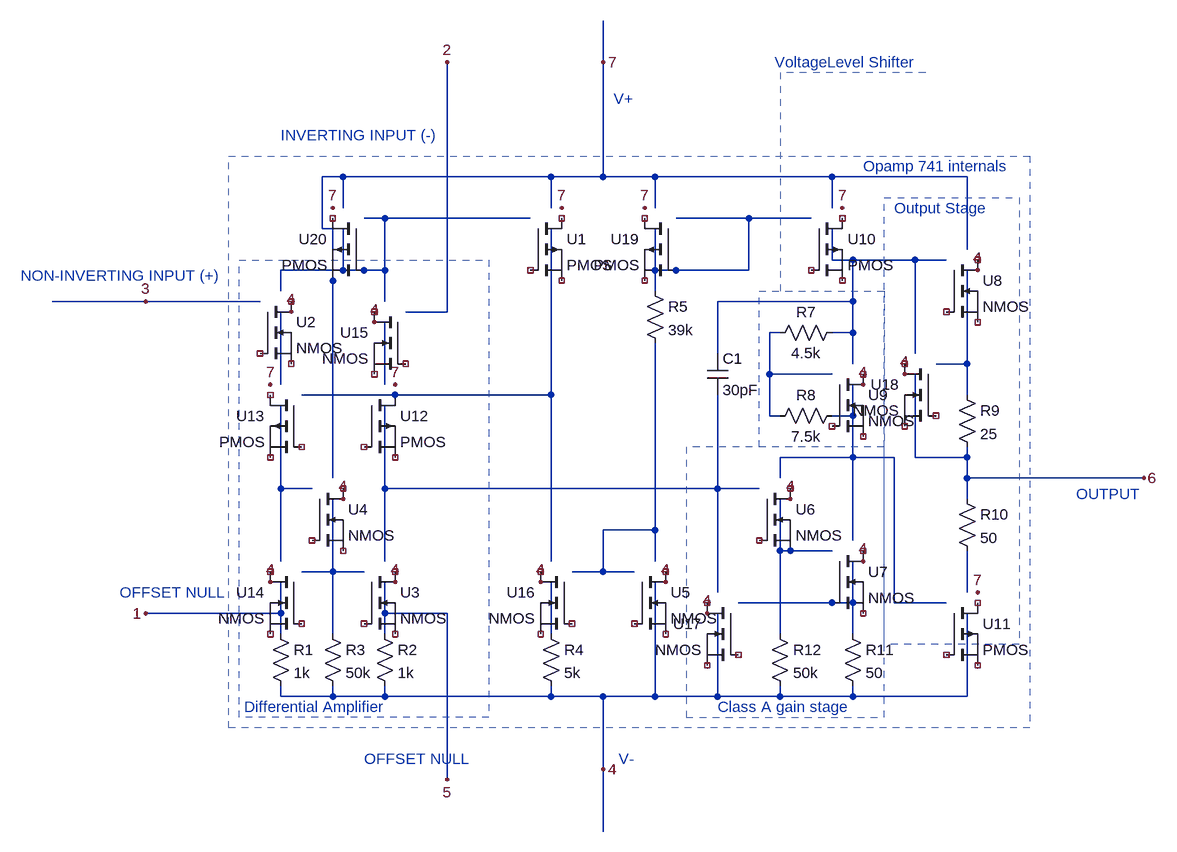
[diagram p0: schematic 741.asc]
741.asc, the LTspice schematic file:
Version 4
SHEET 1 2824 1124
WIRE 640 -192 640 -256
WIRE 240 -16 208 -16
WIRE 560 -16 240 -16
WIRE 640 -16 640 -192
WIRE 640 -16 560 -16
WIRE 720 -16 640 -16
WIRE 992 -16 720 -16
WIRE 1200 -16 992 -16
WIRE 240 32 240 -16
WIRE 560 32 560 -16
WIRE 720 32 720 -16
WIRE 992 32 992 -16
WIRE 304 48 272 48
WIRE 528 48 304 48
WIRE 864 48 752 48
WIRE 960 48 864 48
WIRE 208 64 208 -16
WIRE 224 64 208 64
WIRE 1200 96 1200 -16
WIRE 992 112 992 64
WIRE 1024 112 992 112
WIRE 1120 112 1024 112
WIRE 1168 112 1120 112
WIRE 240 128 240 64
WIRE 240 128 144 128
WIRE 304 128 304 48
WIRE 304 128 240 128
WIRE 720 128 720 64
WIRE 864 128 864 48
WIRE 864 128 720 128
WIRE 144 160 144 128
WIRE 720 160 720 128
WIRE -64 176 -208 176
WIRE 112 176 -64 176
WIRE 304 176 304 128
WIRE 1024 176 1024 112
WIRE 1024 176 816 176
WIRE 400 192 400 -192
WIRE 400 192 336 192
WIRE 912 224 896 224
WIRE 1024 224 1024 176
WIRE 1024 224 992 224
WIRE 816 256 816 176
WIRE 1120 256 1120 112
WIRE 1024 272 1024 224
WIRE 1200 272 1200 128
WIRE 1200 272 1152 272
WIRE 896 288 896 224
WIRE 992 288 896 288
WIRE 144 304 144 192
WIRE 304 304 304 208
WIRE 272 320 176 320
WIRE 560 320 560 64
WIRE 560 320 272 320
WIRE 1200 320 1200 272
WIRE 896 352 896 288
WIRE 912 352 896 352
WIRE 1024 352 1024 304
WIRE 1024 352 992 352
WIRE 1024 416 1024 352
WIRE 1024 416 912 416
WIRE 1088 416 1024 416
WIRE 1120 416 1120 288
WIRE 1200 416 1200 400
WIRE 1200 416 1120 416
WIRE 224 448 224 64
WIRE 912 448 912 416
WIRE 1200 448 1200 416
WIRE 1472 448 1200 448
WIRE 144 464 144 336
WIRE 192 464 144 464
WIRE 304 464 304 336
WIRE 816 464 816 320
WIRE 816 464 304 464
WIRE 880 464 816 464
WIRE 1200 480 1200 448
WIRE 720 528 720 240
WIRE 720 528 640 528
WIRE 1024 544 1024 416
WIRE 912 560 912 480
WIRE 992 560 912 560
WIRE 144 576 144 464
WIRE 304 576 304 464
WIRE 560 576 560 320
WIRE 720 576 720 528
WIRE 224 592 224 480
WIRE 224 592 176 592
WIRE 272 592 224 592
WIRE 640 592 640 528
WIRE 640 592 592 592
WIRE 688 592 640 592
WIRE 816 624 816 464
WIRE 1200 624 1200 560
WIRE 1024 640 1024 576
WIRE 1024 640 848 640
WIRE 1088 640 1088 416
WIRE 1168 640 1088 640
WIRE 144 656 144 608
WIRE 144 656 -64 656
WIRE 304 656 304 608
WIRE 400 656 304 656
WIRE 144 688 144 656
WIRE 224 688 224 592
WIRE 304 688 304 656
WIRE 560 688 560 608
WIRE 912 688 912 560
WIRE 1024 688 1024 640
WIRE 144 784 144 768
WIRE 224 784 224 768
WIRE 224 784 144 784
WIRE 304 784 304 768
WIRE 304 784 224 784
WIRE 560 784 560 768
WIRE 560 784 304 784
WIRE 640 784 560 784
WIRE 720 784 720 608
WIRE 720 784 640 784
WIRE 816 784 816 656
WIRE 816 784 720 784
WIRE 912 784 912 768
WIRE 912 784 816 784
WIRE 1024 784 1024 768
WIRE 1024 784 912 784
WIRE 1200 784 1200 656
WIRE 1200 784 1024 784
WIRE 640 896 640 784
WIRE 400 912 400 656
WIRE 640 992 640 896
FLAG -64 176 3
FLAG 400 -192 2
FLAG 1472 448 6
FLAG 640 896 4
FLAG 640 -192 7
FLAG -64 656 1
FLAG 400 912 5
FLAG 224 32 7
FLAG 576 32 7
FLAG 704 32 7
FLAG 1008 32 7
FLAG 128 304 7
FLAG 1216 624 7
FLAG 128 608 4
FLAG 240 480 4
FLAG 320 608 4
FLAG 288 208 4
FLAG 160 192 4
FLAG 1040 304 4
FLAG 1104 288 4
FLAG 1216 128 4
FLAG 1040 576 4
FLAG 928 480 4
FLAG 800 656 4
FLAG 736 608 4
FLAG 544 608 4
FLAG 320 304 7
SYMBOL res 128 672 R0
SYMATTR InstName R1
SYMATTR Value 1k
SYMBOL res 288 672 R0
SYMATTR InstName R2
SYMATTR Value 1k
SYMBOL res 208 672 R0
SYMATTR InstName R3
SYMATTR Value 50k
SYMBOL res 544 672 R0
SYMATTR InstName R4
SYMATTR Value 5k
SYMBOL res 704 144 R0
SYMATTR InstName R5
SYMATTR Value 39k
SYMBOL cap 800 256 R0
SYMATTR InstName C1
SYMATTR Value 30pF
SYMBOL res 1008 208 R90
WINDOW 0 0 56 VBottom 2
WINDOW 3 32 56 VTop 2
SYMATTR InstName R7
SYMATTR Value 4.5k
SYMBOL res 1008 336 R90
WINDOW 0 0 56 VBottom 2
WINDOW 3 32 56 VTop 2
SYMATTR InstName R8
SYMATTR Value 7.5k
SYMBOL res 1184 304 R0
SYMATTR InstName R9
SYMATTR Value 25
SYMBOL res 1184 464 R0
SYMATTR InstName R10
SYMATTR Value 50
SYMBOL res 1008 672 R0
SYMATTR InstName R11
SYMATTR Value 50
SYMBOL res 896 672 R0
SYMATTR InstName R12
SYMATTR Value 50k
SYMBOL pmos 528 48 R0
SYMATTR InstName U1
SYMBOL nmos 112 176 R0
SYMATTR InstName U2
SYMBOL nmos 272 592 R0
SYMATTR InstName U3
SYMBOL nmos 192 464 R0
SYMATTR InstName U4
SYMBOL nmos 688 592 R0
SYMATTR InstName U5
SYMBOL nmos 880 464 R0
SYMATTR InstName U6
SYMBOL nmos 992 560 R0
SYMATTR InstName U7
SYMBOL nmos 1168 112 R0
SYMATTR InstName U8
SYMBOL nmos 992 288 R0
SYMATTR InstName U9
SYMBOL pmos 960 48 R0
SYMATTR InstName U10
SYMBOL pmos 1168 640 R0
SYMATTR InstName U11
SYMBOL pmos 272 320 R0
SYMATTR InstName U12
SYMBOL nmos 176 592 M0
SYMATTR InstName U14
SYMBOL nmos 336 192 M0
SYMATTR InstName U15
SYMBOL nmos 592 592 M0
SYMATTR InstName U16
SYMBOL nmos 848 640 M0
SYMATTR InstName U17
SYMBOL nmos 1152 272 M0
SYMATTR InstName U18
SYMBOL pmos 176 320 M0
SYMATTR InstName U13
SYMBOL pmos 752 48 M0
SYMATTR InstName U19
SYMBOL pmos 272 48 M0
SYMATTR InstName U20
TEXT 1040 -32 Left 2 ;Opamp 741 internals
TEXT -256 136 Left 2 ;NON-INVERTING INPUT (+)
TEXT 144 -80 Left 2 ;INVERTING INPUT (-)
TEXT 656 -136 Left 2 ;V+
TEXT 1368 472 Left 2 ;OUTPUT
TEXT 664 880 Left 2 ;V-
TEXT 272 880 Left 2 ;OFFSET NULL
TEXT -104 624 Left 2 ;OFFSET NULL
TEXT 88 800 Left 2 ;Differential Amplifier
TEXT 816 800 Left 2 ;Class A gain stage
TEXT 1088 32 Left 2 ;Output Stage
TEXT 904 -192 Left 2 ;VoltageLevel Shifter
LINE Normal 912 -176 912 160 2
LINE Normal 1136 -176 912 -176 2
RECTANGLE Normal 64 -48 1296 832 2
RECTANGLE Normal 464 816 80 112 2
RECTANGLE Normal 1072 400 880 160 2
RECTANGLE Normal 1072 16 1280 704 2
RECTANGLE Normal 768 816 1072 400 2

The netlist it stands for:
* 741.asc
R1 1 4 1k
R2 5 4 1k
R3 N014 4 50k
R4 N017 4 5k
R5 N002 N012 39k
C1 N003 N011 30pF
R7 N003 N004 4.5k
R8 N009 N004 7.5k
R9 N005 6 25
R10 6 N015 50
R11 N016 4 50
R12 N013 4 50k
* U1: PMOS (symbol pmos not certain, pin order unknown); nets seen at it: 
* U2: NMOS (symbol nmos not certain, pin order unknown); nets seen at it: 
* U3: NMOS (symbol nmos not certain, pin order unknown); nets seen at it: 
* U4: NMOS (symbol nmos not certain, pin order unknown); nets seen at it: 
* U5: NMOS (symbol nmos not certain, pin order unknown); nets seen at it: 
* U6: NMOS (symbol nmos not certain, pin order unknown); nets seen at it: N013
* U7: NMOS (symbol nmos not certain, pin order unknown); nets seen at it: N016
* U8: NMOS (symbol nmos not certain, pin order unknown); nets seen at it: 
* U9: NMOS (symbol nmos not certain, pin order unknown); nets seen at it: 
* U10: PMOS (symbol pmos not certain, pin order unknown); nets seen at it: 
* U11: PMOS (symbol pmos not certain, pin order unknown); nets seen at it: 
* U12: PMOS (symbol pmos not certain, pin order unknown); nets seen at it: N008
* U14: NMOS (symbol nmos not certain, pin order unknown); nets seen at it: 
* U15: NMOS (symbol nmos not certain, pin order unknown); nets seen at it: 
* U16: NMOS (symbol nmos not certain, pin order unknown); nets seen at it: 
* U17: NMOS (symbol nmos not certain, pin order unknown); nets seen at it: 
* U18: NMOS (symbol nmos not certain, pin order unknown); nets seen at it: 
* U13: PMOS (symbol pmos not certain, pin order unknown); nets seen at it: 
* U19: PMOS (symbol pmos not certain, pin order unknown); nets seen at it: N002
* U20: PMOS (symbol pmos not certain, pin order unknown); nets seen at it: 7, N001
* Opamp 741 internals
* NON-INVERTING INPUT (+)
* INVERTING INPUT (-)
* V+
* OUTPUT
* V-
* OFFSET NULL
* OFFSET NULL
* Differential Amplifier
* Class A gain stage
* Output Stage
* VoltageLevel Shifter
.backanno
.end